# EAGLE schematic 101_led_red (EAGLE 7.5.0)
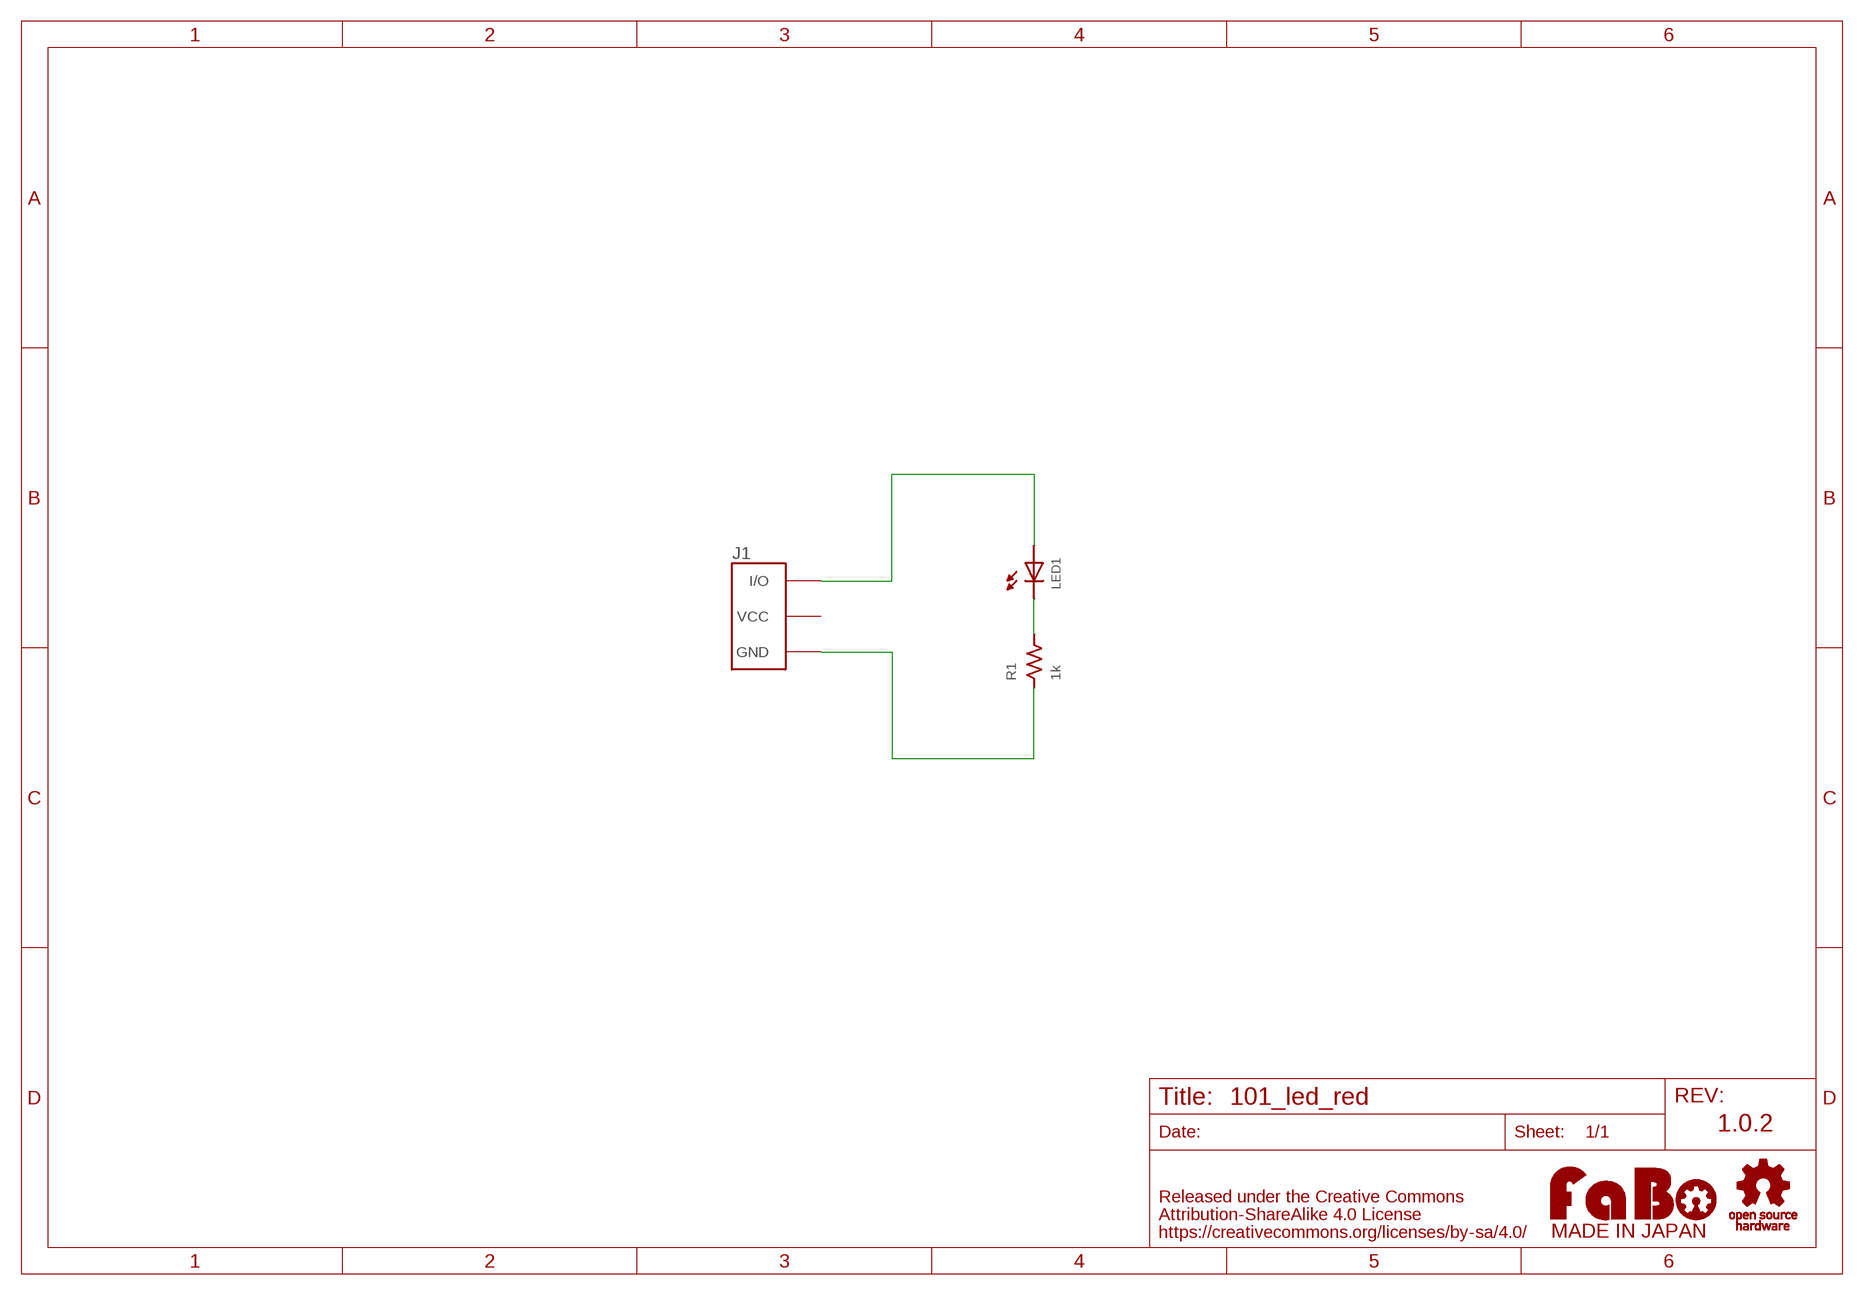
[diagram p0: schematic, sheet 1]

## Parts
J1  FABO_BRICK_3PIN  [FABO_BRICK_3PIN]
LED1  LED-5MM  [LED_5MM]
R1  1k  RESISTOR-AXL-REGULAR  [AXL-REGULAR]
U$1  LOGO_FABO-M  [LOGO_FABO_MS]
U$3  LOGO_OSHW-T_M_BOTTOM  [LOGO_OSHW_T_MS_BOTTOM]

## Nets
GND: J1.GND R1.1
N$1: J1.IN/OUT(I/O) LED1.A(ANODE)
N$3: LED1.K(CATHODE) R1.2
Unconnected: J1.VCC

## Notes on the sheet
- 1.0.2

## Library data of the parts
J1 = FaBo-Template:FABO_BRICK_3PIN: FaBo Brick 3pin
LED1 = FaBo-LED:LED
R1 = FaBo-Resistors:RESISTOR: RESISTOR
U$1 = FaBo-etc:LOGO_FABO
U$3 = FaBo-etc:LOGO_OSHW